# Altium project PCB_Project1.PrjPCB
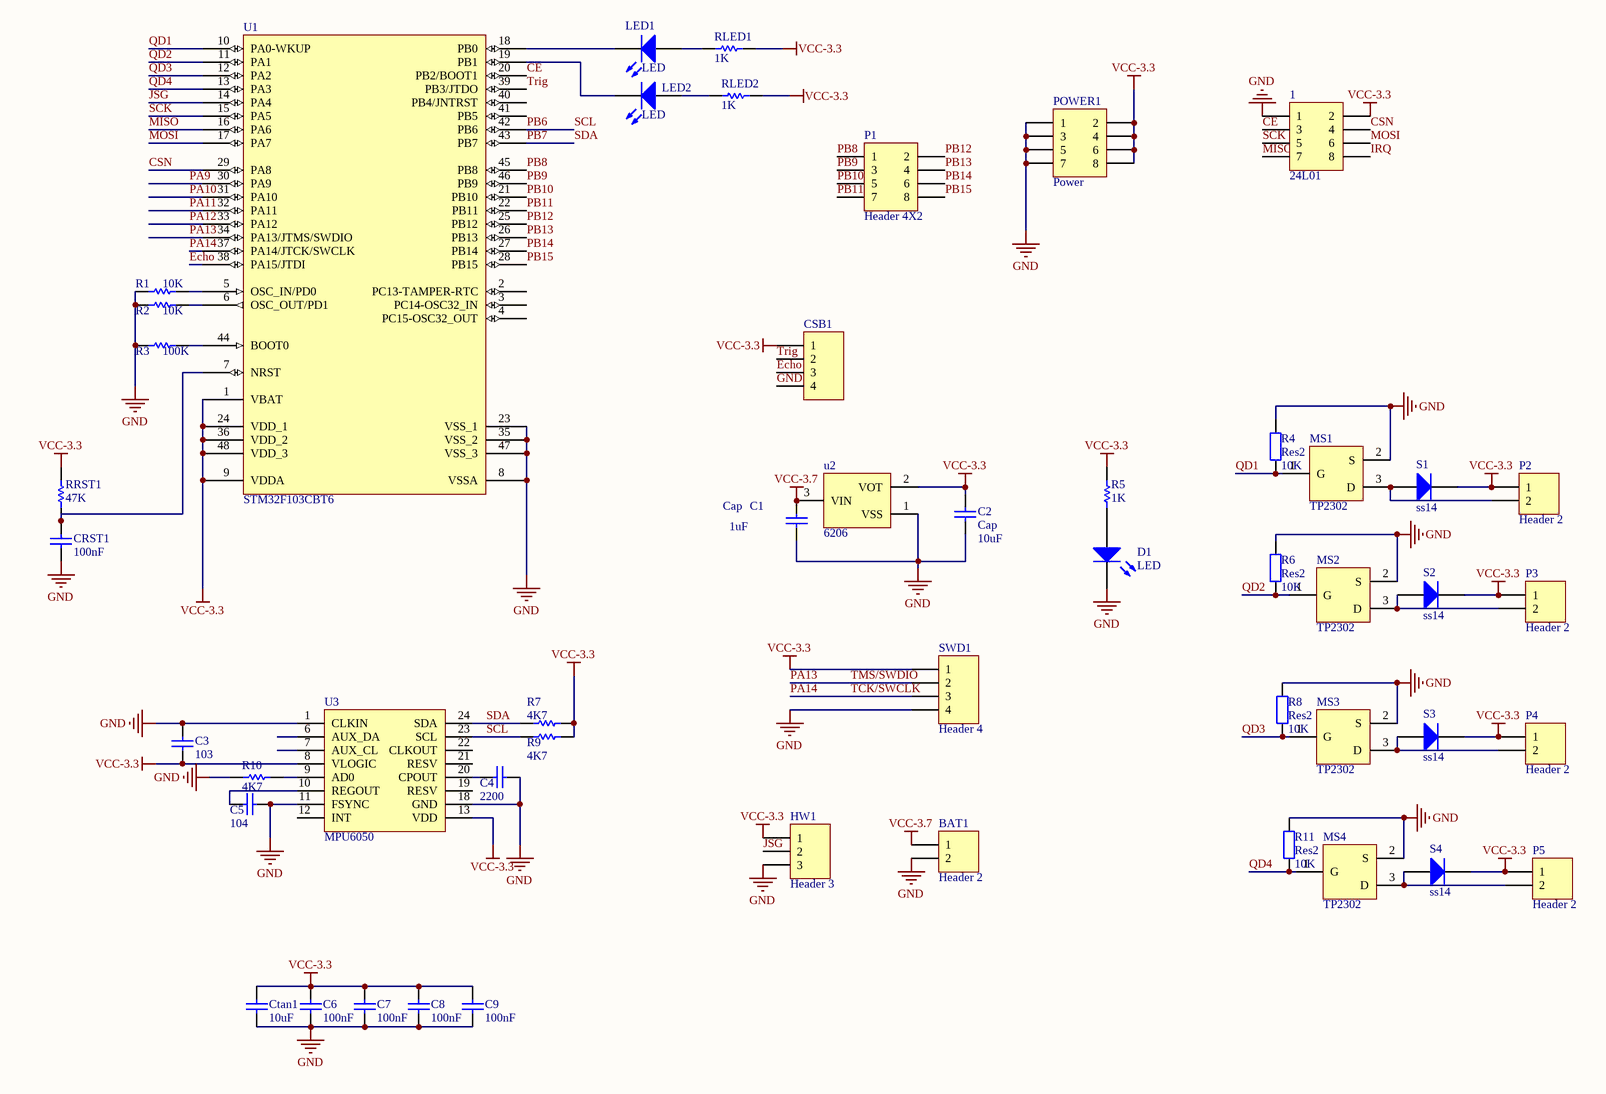
[diagram p0: 比赛飞控.SchDoc]
1 sheet, 50 parts. Net scope: global (net labels, ports and power ports of the same name join across sheets).
Board file: 飞控.PcbDoc

## Sheet 比赛飞控.SchDoc
size A3

### Parts
1  24L01  [HDR2X4]
BAT1  Header 2  [HDR1X2]
C1  Cap  value 1uF  [0805]
C2  Cap  value 10uF  [0805]
C3  value 103  [0805]  (hidden comment: Cap)
C4  value 2200  [0805]  (hidden comment: Cap)
C5  value 104  [0805]  (hidden comment: Cap)
C6  value 100nF  [0805]  (hidden comment: Cap)
C7  value 100nF  [0805]  (hidden comment: Cap)
C8  value 100nF  [0805]  (hidden comment: Cap)
C9  value 100nF  [0805]  (hidden comment: Cap)
CRST1  value 100nF  [0805]  (hidden comment: Cap)
CSB1  (no value)  [HDR1X4]
Ctan1  value 10uF  [0805]  (hidden comment: Cap)
D1  LED  [0805]
HW1  Header 3  [HDR1X3]
LED1  LED  [0805]
LED2  LED  [0805]
MS1  TP2302  [SOT-23]
MS2  TP2302  [SOT-23]
MS3  TP2302  [SOT-23]
MS4  TP2302  [SOT-23]
P1  Header 4X2  [HDR2X4]
P2  Header 2  [HDR1X2]
P3  Header 2  [HDR1X2]
P4  Header 2  [HDR1X2]
P5  Header 2  [HDR1X2]
POWER1  Power  [HDR2X4]
R1  value 10K  [0603]  (hidden comment: Res1)
R2  value 10K  [0603]  (hidden comment: Res1)
R3  value 100K  [0603]  (hidden comment: Res1)
R4  Res2  value 10K  [0805]
R5  value 1K  [0805]  (hidden comment: Res1)
R6  Res2  value 10K  [0805]
R7  value 4K7  [0805]  (hidden comment: Res1)
R8  Res2  value 10K  [0805]
R9  value 4K7  [0805]  (hidden comment: Res1)
R10  value 4K7  [0805]  (hidden comment: Res1)
R11  Res2  value 10K  [0805]
RLED1  value 1K  [0805]  (hidden comment: Res1)
RLED2  value 1K  [0805]  (hidden comment: Res1)
RRST1  value 47K  [0805]  (hidden comment: Res1)
S1  ss14  [SOD-323]
S2  ss14  [SOD-323]
S3  ss14  [SOD-323]
S4  ss14  [SOD-323]
SWD1  Header 4  [HDR1X4]
U1  STM32F103CBT6  [LQFP48_N]
u2  6206  [SOT346-3AN]
U3  MPU6050  [QFN-24]

### Nets
GND: 1.1 BAT1.2 C1.2 C2.2 C3.2 C4.2 C5.1 C6.1 C7.1 C8.1 C9.1 CRST1.2 CSB1.4 Ctan1.1 D1.2(K) HW1.3 MS1.2(S) MS2.2(S) MS3.2(S) MS4.2(S) POWER1.1 POWER1.3 POWER1.5 POWER1.7 R1.1 R2.1 R3.1 R4.2 R6.2 R8.2 R10.1 R11.2 SWD1.4 U1.8(VSSA) U1.23(VSS_1) U1.35(VSS_2) U1.47(VSS_3) u2.1(VSS) U3.1(CLKIN) U3.11(FSYNC) U3.18(GND)
VCC-3.3: 1.2 C2.1 C3.1 C6.2 C7.2 C8.2 C9.2 CSB1.1 Ctan1.2 HW1.1 P2.1 P3.1 P4.1 P5.1 POWER1.2 POWER1.4 POWER1.6 POWER1.8 R5.2 R7.2 R9.2 RLED1.1 RLED2.1 RRST1.2 S1.2(K) S2.2(K) S3.2(K) S4.2(K) SWD1.1 U1.1(VBAT) U1.9(VDDA) U1.24(VDD_1) U1.36(VDD_2) U1.48(VDD_3) u2.2(VOT) U3.8(VLOGIC) U3.13(VDD)
VCC-3.7: BAT1.1 C1.1 u2.3(VIN)
CE: 1.3 U1.20(PB2/BOOT1)
CSN: 1.4 U1.29(PA8)
Echo: CSB1.3 U1.38(PA15/JTDI)
IRQ: 1.8
JSG: HW1.2 U1.14(PA4)
MISO: 1.7 U1.16(PA6)
MOSI: 1.6 U1.17(PA7)
PA9: U1.30(PA9)
PA10: U1.31(PA10)
PA11: U1.32(PA11)
PA12: U1.33(PA12)
PA13: SWD1.2 U1.34(PA13/JTMS/SWDIO)  [also labelled TMS/SWDIO]
PA14: SWD1.3 U1.37(PA14/JTCK/SWCLK)  [also labelled TCK/SWCLK]
PB6: R9.1 U1.42(PB6) U3.23(SCL)  [also labelled SCL]
PB7: R7.1 U1.43(PB7) U3.24(SDA)  [also labelled SDA]
PB8: P1.1 U1.45(PB8)
PB9: P1.3 U1.46(PB9)
PB10: P1.5 U1.21(PB10)
PB11: P1.7 U1.22(PB11)
PB12: P1.2 U1.25(PB12)
PB13: P1.4 U1.26(PB13)
PB14: P1.6 U1.27(PB14)
PB15: P1.8 U1.28(PB15)
QD1: MS1.1(G) R4.1 U1.10(PA0-WKUP)
QD2: MS2.1(G) R6.1 U1.11(PA1)
QD3: MS3.1(G) R8.1 U1.12(PA2)
QD4: MS4.1(G) R11.1 U1.13(PA3)
SCK: 1.5 U1.15(PA5)
Trig: CSB1.2 U1.39(PB3/JTDO)
NetC4_1: C4.1 U3.20(CPOUT)
NetC5_2: C5.2 U3.10(REGOUT)
NetCRST1_1: CRST1.1 RRST1.1 U1.7(NRST)
NetD1_1: D1.1(A) R5.1
NetLED1_1: LED1.1(A) RLED1.2
NetLED1_2: LED1.2(K) U1.18(PB0)
NetLED2_1: LED2.1(A) RLED2.2
NetLED2_2: LED2.2(K) U1.19(PB1)
NetMS1_3: MS1.3(D) P2.2 S1.1(A)
NetMS2_3: MS2.3(D) P3.2 S2.1(A)
NetMS3_3: MS3.3(D) P4.2 S3.1(A)
NetMS4_3: MS4.3(D) P5.2 S4.1(A)
NetR1_2: R1.2 U1.5(OSC_IN/PD0)
NetR2_2: R2.2 U1.6(OSC_OUT/PD1)
NetR3_2: R3.2 U1.44(BOOT0)
NetR10_2: R10.2 U3.9(AD0)

Not connected (* = marked no-connect by the designer): U1 2(PC13-TAMPER-RTC) 3(PC14-OSC32_IN) 4(PC15-OSC32_OUT) 40(PB4/JNTRST) 41(PB5); U3 6(AUX_DA) 7(AUX_CL) 12(INT) 19(RESV) 21(RESV) 22(CLKOUT)

### Library data of the parts
1 P1 POWER1 = Header 4X2: Header, 4-Pin, Dual row; LatestRevisionDate: 17-Jul-2002; LatestRevisionNote: Re-released for DXP Platform.; Publisher: Altium Limited
BAT1 P2-P5 = Header 2: Header, 2-Pin; LatestRevisionDate: 17-Jul-2002; LatestRevisionNote: Re-released for DXP Platform.; Publisher: Altium Limited
C1-C9 CRST1 Ctan1 = Cap: Capacitor; Published: 8-Jun-2000; LatestRevisionDate: 17-Jul-2002; LatestRevisionNote: Re-released for DXP Platform.; PackageReference: RAD-0.3; Publisher: Altium Limited
  C3-C9 CRST1 Ctan1: PackageDescription: Radial Cap, Thru-Hole; 2 Leads; 0.3 in Pin Spacing
CSB1 SWD1 = Header 4: Header, 4-Pin; LatestRevisionDate: 17-Jul-2002; LatestRevisionNote: Re-released for DXP Platform.; Publisher: Altium Limited
D1 LED1 LED2 = LED3: Typical BLUE SiC LED; Published: 8-Jun-2000; LatestRevisionDate: 17-Dec-2003; LatestRevisionNote: PCB Footprint replaced.; DatasheetVersion: 16-Apr-2002; PackageVersion: 16-Apr-2002; PackageReference: 3.5X2.8X1.9; Publisher: Altium Limited; PackageDescription: SM LED; 2 C-Bend Leads; Body 3.5 x 2.8 x 1.9 mm, inc leads (LxWxH typ)
HW1 = Header 3: Header, 3-Pin; LatestRevisionDate: 17-Jul-2002; LatestRevisionNote: Re-released for DXP Platform.; Publisher: Altium Limited
R1-R3 R5 R7 R9 R10 RLED1 RLED2 RRST1 = Res1: Resistor; Published: 8-Jun-2000; LatestRevisionDate: 17-Jul-2002; LatestRevisionNote: Re-released for DXP Platform.; PackageReference: AXIAL-0.3; Publisher: Altium Limited; PackageDescription: Axial Device, Thru-Hole; 2 Leads; 0.3 in Pin Spacing
R4 R6 R8 R11 = Res2: Resistor; Published: 8-Jun-2000; LatestRevisionDate: 17-Jul-2002; LatestRevisionNote: Re-released for DXP Platform.; PackageReference: AXIAL-0.4; Publisher: Altium Limited
S1-S4 = Diode 1N5406: 3 Amp General Purpose Rectifier; Published: 8-Jun-2000; LatestRevisionDate: 17-Jul-2002; LatestRevisionNote: Re-released for DXP Platform.; DatasheetVersion: 1998; PackageVersion: Aug-1999; PackageReference: DO-201AD; Publisher: Altium Limited; ComponentLink1Description: Manufacturer Link; ComponentLink1URL: http://www.fairchildsemi.com/; ComponentLink2Description: Datasheet; ComponentLink2URL: http://www.fairchildsemi.com/ds/1N%2F1N5400.pdf
U1 = STM32F103CBT6: STM32 ARM-based 32-bit MCU with 128 Kbytes Flash, 48-pin LQFP, Industrial Temperature; Published: 30-May-2008; DatasheetVersion: rev6, Mar-2008; PackageVersion: Mar-2008; PackageReference: LQFP48; Publisher: Altium Limited; PackageDescription: 48-Pin Low-Profile Quad Flat Pack, 7 x 7 mm Body, 0.5 mm Pitch (LQFP48); ComponentLink1Description: Manufacturer Link; ComponentLink1URL: www.st.com/stm32; ComponentLink2Description: Datasheet; ComponentLink2URL: http://www.st.com/stonline/products/literature/ds/13587.pdf
U3 = MPU6050: Hex-Axis Sensor